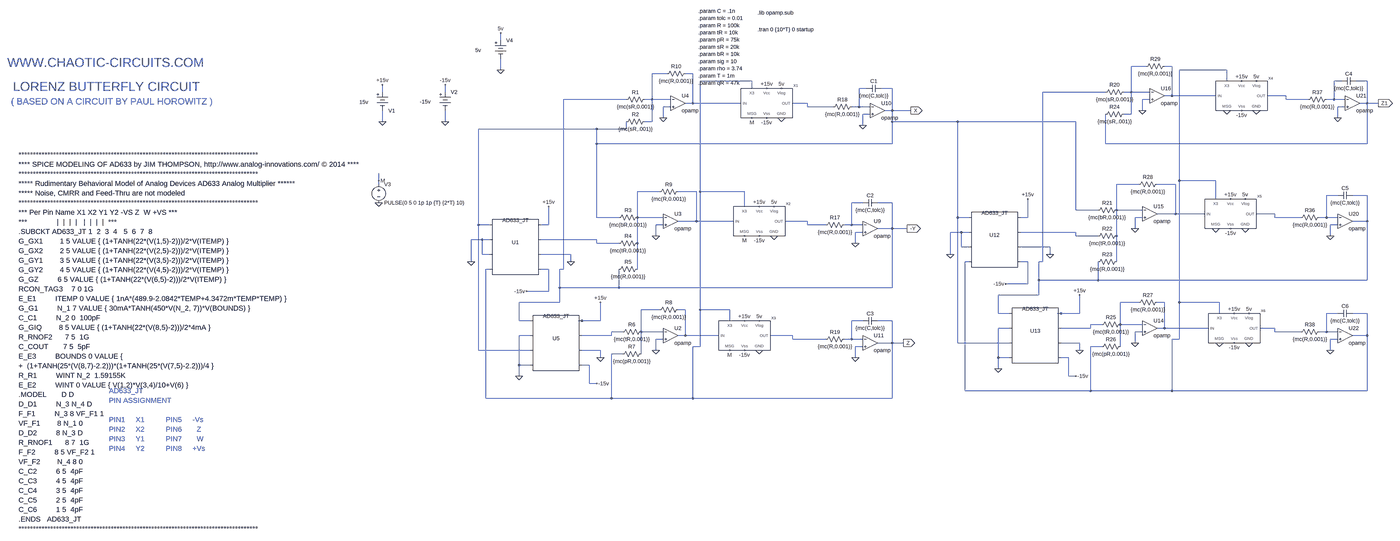
[diagram p0: schematic CSK_TS_MC_03.asc, whole sheet]
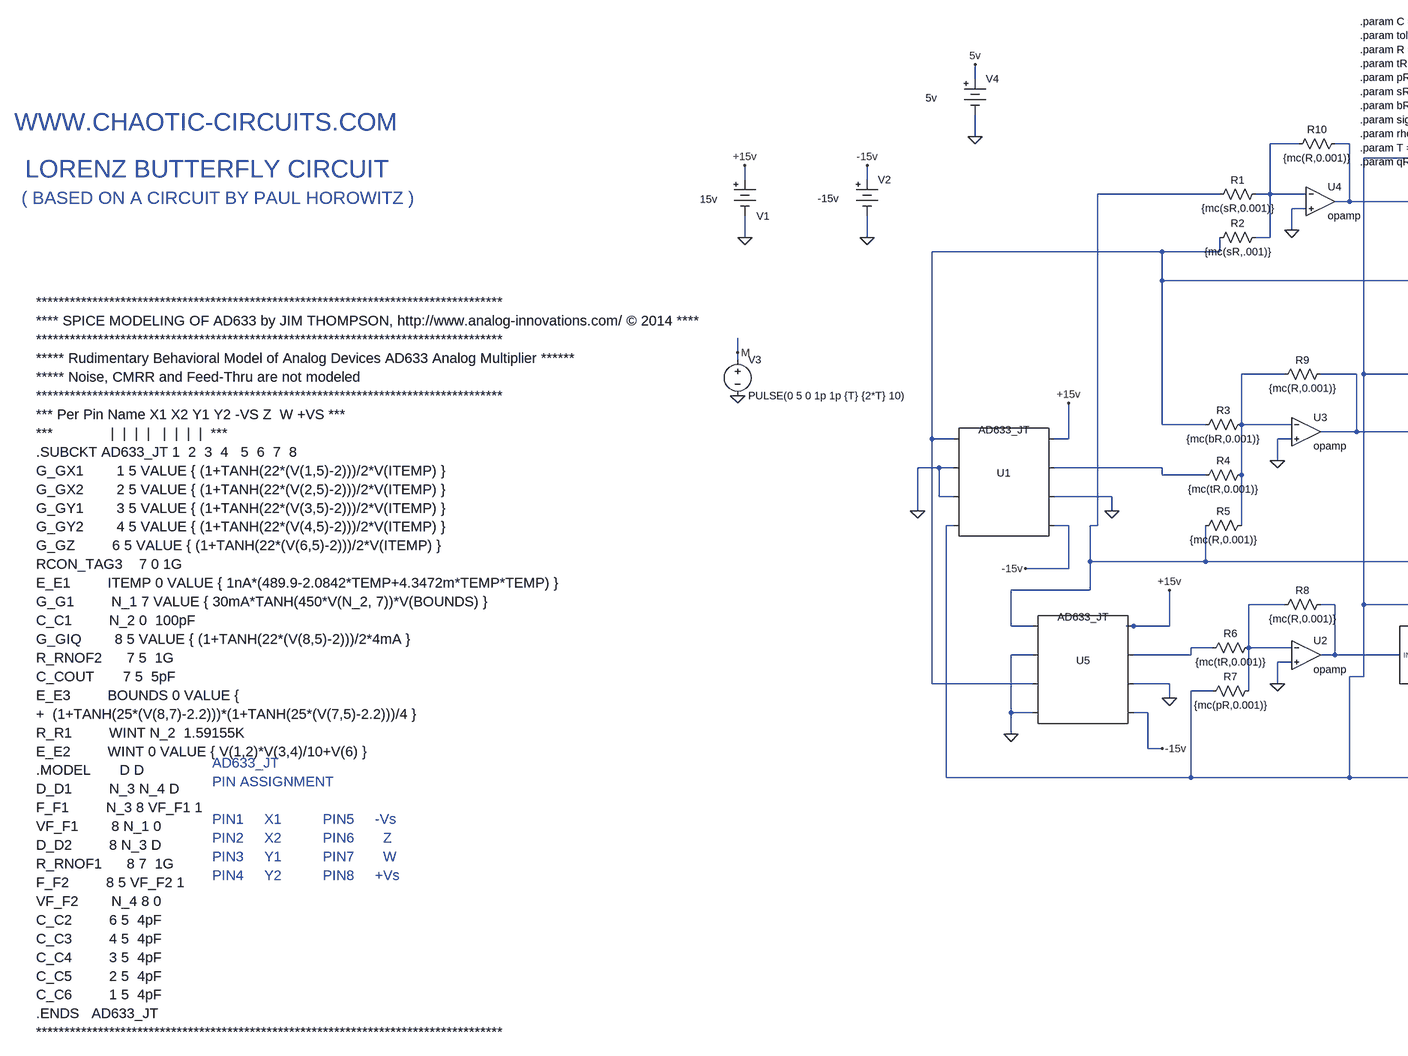
[diagram p1: schematic CSK_TS_MC_03.asc, part, row 1 of 1, column 1 of 2]
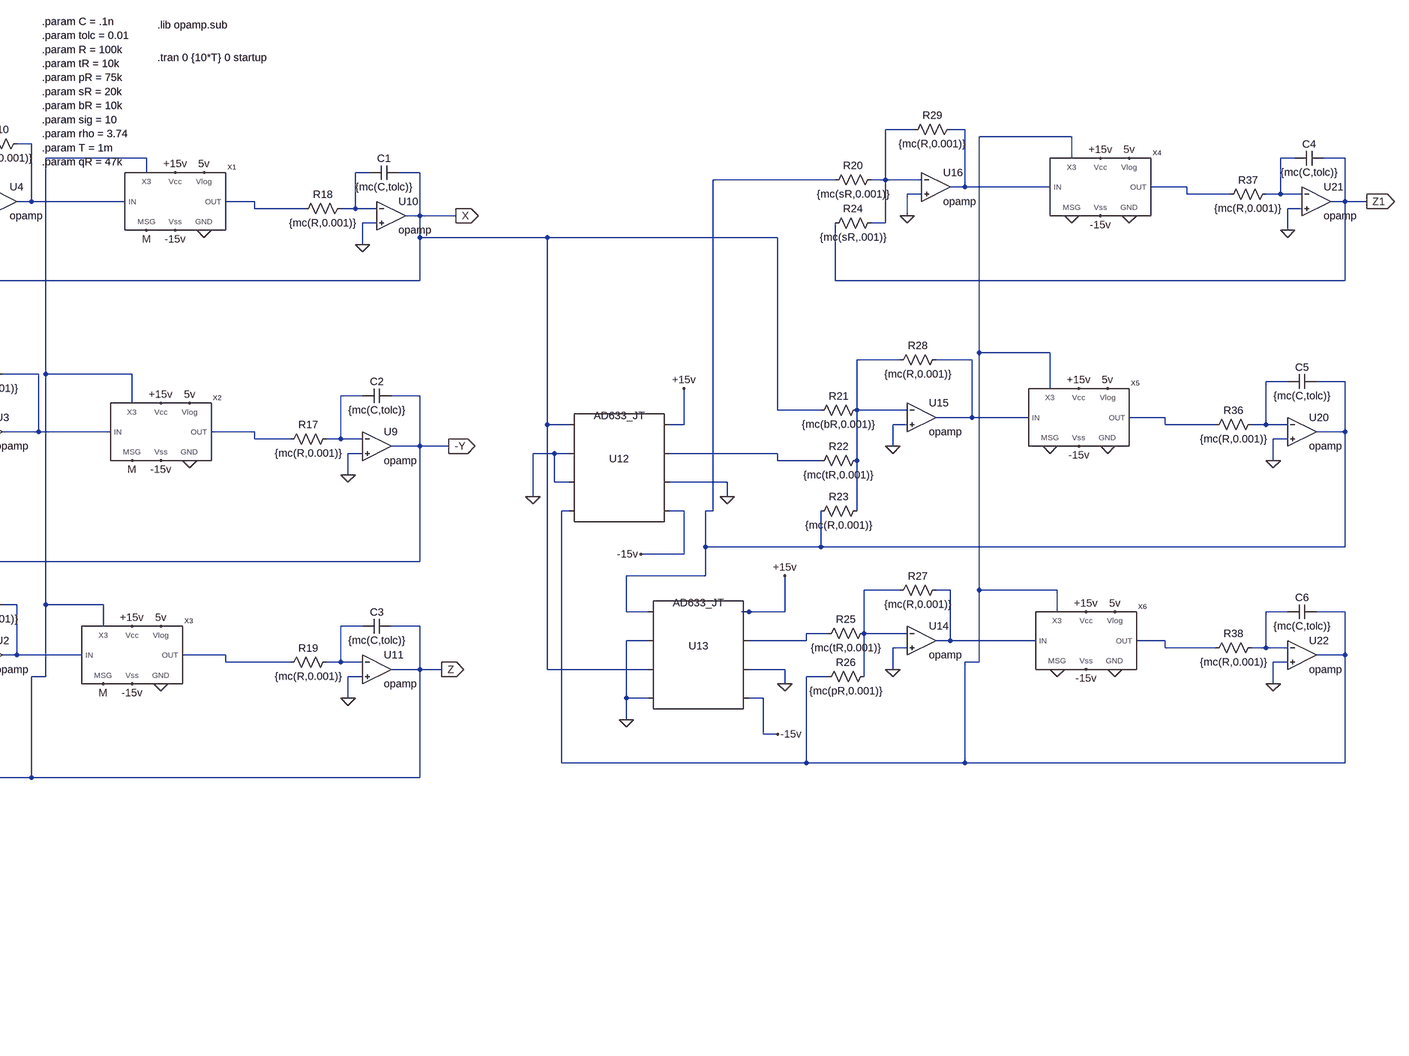
[diagram p2: schematic CSK_TS_MC_03.asc, part, row 1 of 1, column 2 of 2]
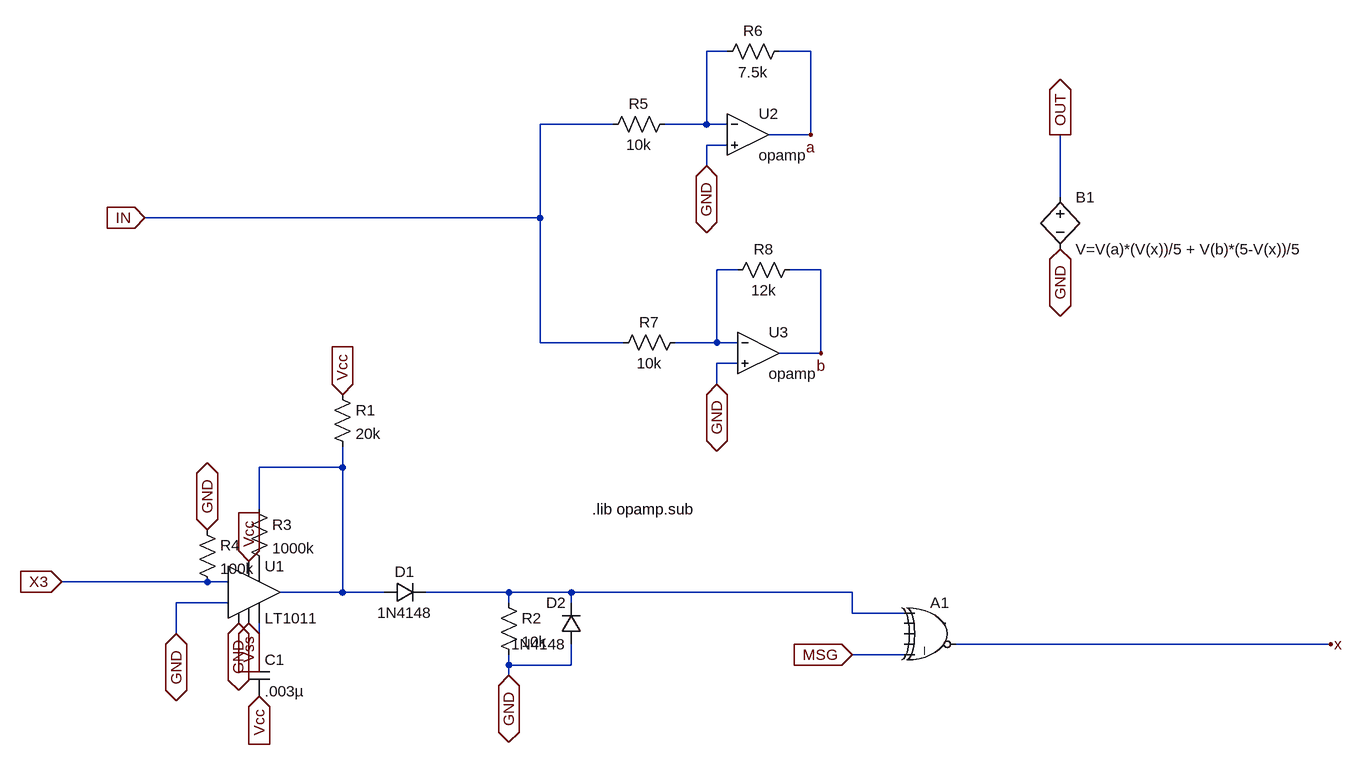
[diagram p3: sub-circuit tsblock_2.asc]
CSK_TS_MC_03.asc, the LTspice schematic file:
Version 4
SHEET 1 880 2376
WIRE -4160 400 -4160 368
WIRE -800 512 -864 512
WIRE -688 512 -720 512
WIRE -4160 528 -4160 480
WIRE -432 528 -656 528
WIRE -3440 544 -3504 544
WIRE -3328 544 -3360 544
WIRE -3072 576 -3296 576
WIRE -432 576 -432 528
WIRE 64 576 32 576
WIRE 176 576 128 576
WIRE -3072 608 -3072 576
WIRE -2576 608 -2608 608
WIRE -2464 608 -2512 608
WIRE -4672 624 -4672 592
WIRE -4400 624 -4400 592
WIRE -976 624 -1248 624
WIRE -864 624 -864 512
WIRE -864 624 -896 624
WIRE -784 624 -864 624
WIRE -688 640 -688 512
WIRE -688 640 -720 640
WIRE -480 640 -688 640
WIRE -176 640 -256 640
WIRE -3616 656 -3888 656
WIRE -3504 656 -3504 544
WIRE -3504 656 -3536 656
WIRE -3424 656 -3504 656
WIRE -784 656 -816 656
WIRE -176 656 -176 640
WIRE -80 656 -176 656
WIRE 32 656 32 576
WIRE 32 656 0 656
WIRE 80 656 32 656
WIRE -3328 672 -3328 544
WIRE -3328 672 -3360 672
WIRE -3120 672 -3328 672
WIRE -2832 672 -2896 672
WIRE 176 672 176 576
WIRE 176 672 144 672
WIRE 224 672 176 672
WIRE -3424 688 -3456 688
WIRE -2832 688 -2832 672
WIRE -2720 688 -2832 688
WIRE -2608 688 -2608 608
WIRE -2608 688 -2640 688
WIRE -2560 688 -2608 688
WIRE 80 688 48 688
WIRE -2464 704 -2464 608
WIRE -2464 704 -2496 704
WIRE -2384 704 -2464 704
WIRE -816 704 -816 656
WIRE -2560 720 -2592 720
WIRE -864 720 -864 624
WIRE -864 720 -896 720
WIRE -3456 736 -3456 688
WIRE 48 736 48 688
WIRE -4672 752 -4672 704
WIRE -4400 752 -4400 704
WIRE -3504 752 -3504 656
WIRE -3504 752 -3536 752
WIRE -2464 752 -2464 704
WIRE -1616 752 -2464 752
WIRE -1104 752 -1616 752
WIRE -2592 768 -2592 720
WIRE -3744 784 -4256 784
WIRE -3616 784 -3616 752
WIRE -3616 784 -3744 784
WIRE -3744 848 -3744 784
WIRE -2464 848 -2464 752
WIRE -2464 848 -3744 848
WIRE -976 848 -976 720
WIRE 176 848 176 672
WIRE 176 848 -976 848
WIRE -4688 1008 -4688 976
WIRE -656 1008 -656 528
WIRE -480 1008 -656 1008
WIRE -4688 1024 -4688 1008
WIRE -832 1024 -928 1024
WIRE -672 1024 -752 1024
WIRE -3472 1056 -3568 1056
WIRE -3312 1056 -3392 1056
WIRE -3296 1056 -3296 576
WIRE -3104 1056 -3296 1056
WIRE 48 1072 0 1072
WIRE 176 1072 112 1072
WIRE -480 1088 -480 1008
WIRE -2592 1104 -2640 1104
WIRE -2464 1104 -2528 1104
WIRE -3104 1120 -3104 1056
WIRE -1104 1136 -1104 752
WIRE -1008 1136 -1104 1136
WIRE -928 1136 -928 1024
WIRE -816 1136 -928 1136
WIRE -672 1152 -672 1024
WIRE -672 1152 -752 1152
WIRE -528 1152 -672 1152
WIRE -224 1152 -304 1152
WIRE -3744 1168 -3744 848
WIRE -3648 1168 -3744 1168
WIRE -3568 1168 -3568 1056
WIRE -3456 1168 -3568 1168
WIRE -1616 1168 -1616 752
WIRE -1568 1168 -1616 1168
WIRE -1312 1168 -1312 1088
WIRE -1312 1168 -1344 1168
WIRE -816 1168 -848 1168
WIRE -224 1168 -224 1152
WIRE -112 1168 -224 1168
WIRE 0 1168 0 1072
WIRE 0 1168 -32 1168
WIRE 48 1168 0 1168
WIRE -3312 1184 -3312 1056
WIRE -3312 1184 -3392 1184
WIRE -3152 1184 -3312 1184
WIRE -2832 1184 -2928 1184
WIRE 176 1184 176 1072
WIRE 176 1184 112 1184
WIRE -4256 1200 -4256 784
WIRE -4208 1200 -4256 1200
WIRE -3952 1200 -3952 1120
WIRE -3952 1200 -3984 1200
WIRE -3456 1200 -3488 1200
WIRE -2832 1200 -2832 1184
WIRE -2752 1200 -2832 1200
WIRE -2640 1200 -2640 1104
WIRE -2640 1200 -2672 1200
WIRE -2592 1200 -2640 1200
WIRE 48 1200 16 1200
WIRE -2464 1216 -2464 1104
WIRE -2464 1216 -2528 1216
WIRE -2400 1216 -2464 1216
WIRE -848 1216 -848 1168
WIRE -2592 1232 -2624 1232
WIRE -1600 1232 -1648 1232
WIRE -1568 1232 -1600 1232
WIRE -1104 1232 -1344 1232
WIRE -3488 1248 -3488 1200
WIRE -1104 1248 -1104 1232
WIRE -1008 1248 -1104 1248
WIRE -928 1248 -928 1136
WIRE 16 1248 16 1200
WIRE -4240 1264 -4288 1264
WIRE -4208 1264 -4240 1264
WIRE -3744 1264 -3984 1264
WIRE -3744 1280 -3744 1264
WIRE -3648 1280 -3744 1280
WIRE -3568 1280 -3568 1168
WIRE -2624 1280 -2624 1232
WIRE -1600 1296 -1600 1232
WIRE -1568 1296 -1600 1296
WIRE -1216 1296 -1344 1296
WIRE -4240 1328 -4240 1264
WIRE -4208 1328 -4240 1328
WIRE -3856 1328 -3984 1328
WIRE -1648 1328 -1648 1232
WIRE -1216 1328 -1216 1296
WIRE -4288 1360 -4288 1264
WIRE -3856 1360 -3856 1328
WIRE -1568 1360 -1584 1360
WIRE -1312 1360 -1344 1360
WIRE -1248 1360 -1248 624
WIRE -1248 1360 -1264 1360
WIRE -928 1360 -928 1248
WIRE -4208 1392 -4224 1392
WIRE -3952 1392 -3984 1392
WIRE -3888 1392 -3888 656
WIRE -3888 1392 -3904 1392
WIRE -3568 1392 -3568 1280
WIRE -1264 1440 -1264 1360
WIRE -1008 1440 -1008 1360
WIRE -1008 1440 -1264 1440
WIRE 176 1440 176 1184
WIRE 176 1440 -1008 1440
WIRE -1312 1456 -1312 1360
WIRE -1312 1456 -1408 1456
WIRE -3904 1472 -3904 1392
WIRE -3648 1472 -3648 1392
WIRE -3648 1472 -3904 1472
WIRE -2464 1472 -2464 1216
WIRE -2464 1472 -3648 1472
WIRE -3952 1488 -3952 1392
WIRE -3952 1488 -4048 1488
WIRE -1264 1504 -1264 1440
WIRE -1264 1504 -1440 1504
WIRE -3904 1536 -3904 1472
WIRE -3904 1536 -4080 1536
WIRE -832 1536 -912 1536
WIRE -720 1536 -752 1536
WIRE -656 1536 -656 1008
WIRE -464 1536 -656 1536
WIRE -3472 1568 -3552 1568
WIRE -3360 1568 -3392 1568
WIRE -3296 1568 -3296 1056
WIRE -3168 1568 -3296 1568
WIRE -1440 1584 -1440 1504
WIRE -1392 1584 -1440 1584
WIRE -1168 1584 -1184 1584
WIRE -1088 1584 -1088 1504
WIRE -1088 1584 -1168 1584
WIRE -464 1584 -464 1536
WIRE 48 1584 0 1584
WIRE 176 1584 112 1584
WIRE -4080 1616 -4080 1536
WIRE -4032 1616 -4080 1616
WIRE -3808 1616 -3824 1616
WIRE -3728 1616 -3728 1536
WIRE -3728 1616 -3808 1616
WIRE -3168 1616 -3168 1568
WIRE -2592 1616 -2640 1616
WIRE -2464 1616 -2528 1616
WIRE -992 1632 -1040 1632
WIRE -912 1632 -912 1536
WIRE -816 1632 -912 1632
WIRE -1392 1648 -1440 1648
WIRE -1040 1648 -1040 1632
WIRE -1040 1648 -1168 1648
WIRE -720 1648 -720 1536
WIRE -720 1648 -752 1648
WIRE -512 1648 -720 1648
WIRE -224 1648 -288 1648
WIRE -3632 1664 -3680 1664
WIRE -3552 1664 -3552 1568
WIRE -3456 1664 -3552 1664
WIRE -816 1664 -848 1664
WIRE -224 1664 -224 1648
WIRE -112 1664 -224 1664
WIRE 0 1664 0 1584
WIRE 0 1664 -32 1664
WIRE 48 1664 0 1664
WIRE -4032 1680 -4080 1680
WIRE -3680 1680 -3680 1664
WIRE -3680 1680 -3808 1680
WIRE -3360 1680 -3360 1568
WIRE -3360 1680 -3392 1680
WIRE -3216 1680 -3360 1680
WIRE -2896 1680 -2992 1680
WIRE 176 1680 176 1584
WIRE 176 1680 112 1680
WIRE -3456 1696 -3488 1696
WIRE -2896 1696 -2896 1680
WIRE -2752 1696 -2896 1696
WIRE -2640 1696 -2640 1616
WIRE -2640 1696 -2672 1696
WIRE -2592 1696 -2640 1696
WIRE -656 1696 -656 1536
WIRE -656 1696 -688 1696
WIRE 48 1696 16 1696
WIRE -2464 1712 -2464 1616
WIRE -2464 1712 -2528 1712
WIRE -2416 1712 -2464 1712
WIRE -1616 1712 -1616 1168
WIRE -1392 1712 -1616 1712
WIRE -1088 1712 -1168 1712
WIRE -848 1712 -848 1664
WIRE -3296 1728 -3296 1568
WIRE -3296 1728 -3328 1728
WIRE -2592 1728 -2624 1728
WIRE -992 1728 -1040 1728
WIRE -912 1728 -912 1632
WIRE -4256 1744 -4256 1200
WIRE -4032 1744 -4256 1744
WIRE -3728 1744 -3808 1744
WIRE -3488 1744 -3488 1696
WIRE -1088 1744 -1088 1712
WIRE 16 1744 16 1696
WIRE -3632 1760 -3680 1760
WIRE -3552 1760 -3552 1664
WIRE -3728 1776 -3728 1744
WIRE -2624 1776 -2624 1728
WIRE -1440 1776 -1440 1648
WIRE -1392 1776 -1440 1776
WIRE -1136 1776 -1168 1776
WIRE -4080 1808 -4080 1680
WIRE -4032 1808 -4080 1808
WIRE -3776 1808 -3808 1808
WIRE -1440 1824 -1440 1776
WIRE -4080 1856 -4080 1808
WIRE -1136 1856 -1136 1776
WIRE -1104 1856 -1136 1856
WIRE -3776 1888 -3776 1808
WIRE -3744 1888 -3776 1888
WIRE -1584 1920 -1584 1360
WIRE -1040 1920 -1040 1728
WIRE -1040 1920 -1584 1920
WIRE -688 1920 -688 1696
WIRE -688 1920 -1040 1920
WIRE 176 1920 176 1680
WIRE 176 1920 -688 1920
WIRE -4224 1952 -4224 1392
WIRE -3680 1952 -3680 1760
WIRE -3680 1952 -4224 1952
WIRE -3328 1952 -3328 1728
WIRE -3328 1952 -3680 1952
WIRE -2464 1952 -2464 1712
WIRE -2464 1952 -3328 1952
FLAG -2416 1712 Z
IOPIN -2416 1712 Out
FLAG -3456 736 0
FLAG -3488 1248 0
FLAG -3488 1744 0
FLAG -4672 752 0
FLAG -4400 752 0
FLAG -2400 1216 -Y
IOPIN -2400 1216 Out
FLAG -4672 592 +15v
FLAG -4400 592 -15v
FLAG -3952 1120 +15v
FLAG -3728 1536 +15v
FLAG -3744 1888 -15v
FLAG -4048 1488 -15v
FLAG -3728 1776 0
FLAG -3856 1360 0
FLAG -4288 1360 0
FLAG -4080 1856 0
FLAG -4688 1104 0
FLAG -4688 1008 M
FLAG -2384 704 X
IOPIN -2384 704 Out
FLAG -2624 1280 0
FLAG -2592 768 0
FLAG -2624 1776 0
FLAG 224 672 Z1
IOPIN 224 672 Out
FLAG -816 704 0
FLAG -848 1216 0
FLAG -848 1712 0
FLAG -1312 1088 +15v
FLAG -1088 1504 +15v
FLAG -1104 1856 -15v
FLAG -1408 1456 -15v
FLAG -1088 1744 0
FLAG -1216 1328 0
FLAG -1648 1328 0
FLAG -1440 1824 0
FLAG 16 1248 0
FLAG 48 736 0
FLAG 16 1744 0
FLAG -2976 1248 0
FLAG -2944 736 0
FLAG -3040 1744 0
FLAG -432 704 0
FLAG -304 704 0
FLAG -480 1216 0
FLAG -352 1216 0
FLAG -464 1712 0
FLAG -336 1712 0
FLAG -3040 1120 +15v
FLAG -3008 608 +15v
FLAG -3104 1616 +15v
FLAG -368 576 +15v
FLAG -416 1088 +15v
FLAG -400 1584 +15v
FLAG -400 1712 -15v
FLAG -416 1216 -15v
FLAG -368 704 -15v
FLAG -3008 736 -15v
FLAG -3040 1248 -15v
FLAG -3104 1744 -15v
FLAG -3072 736 M
FLAG -3104 1248 M
FLAG -3168 1744 M
FLAG -4160 528 0
FLAG -4160 368 5v
FLAG -2944 608 5v
FLAG -2976 1120 5v
FLAG -3040 1616 5v
FLAG -352 1088 5v
FLAG -336 1584 5v
FLAG -304 576 5v
SYMBOL res -3632 672 R270
WINDOW 0 32 56 VTop 2
WINDOW 3 0 56 VBottom 2
SYMATTR InstName R1
SYMATTR Value {mc(sR,0.001)}
SYMATTR SpiceLine tol=1
SYMBOL res -3664 1184 R270
WINDOW 0 32 56 VTop 2
WINDOW 3 0 56 VBottom 2
SYMATTR InstName R3
SYMATTR Value {mc(bR,0.001)}
SYMATTR SpiceLine tol=1
SYMBOL res -3664 1296 R270
WINDOW 0 32 56 VTop 2
WINDOW 3 0 56 VBottom 2
SYMATTR InstName R4
SYMATTR Value {mc(tR,0.001)}
SYMATTR SpiceLine tol=1
SYMBOL res -3664 1408 R270
WINDOW 0 32 56 VTop 2
WINDOW 3 0 56 VBottom 2
SYMATTR InstName R5
SYMATTR Value {mc(R,0.001)}
SYMATTR SpiceLine tol=1
SYMBOL res -3632 768 R270
WINDOW 0 32 56 VTop 2
WINDOW 3 0 56 VBottom 2
SYMATTR InstName R2
SYMATTR Value {mc(sR,.001)}
SYMATTR SpiceLine tol=1
SYMBOL cap -2576 624 R270
WINDOW 0 32 32 VTop 2
WINDOW 3 0 32 VBottom 2
SYMATTR InstName C1
SYMATTR Value {mc(C,tolc)}
SYMBOL cap -2592 1120 R270
WINDOW 0 32 32 VTop 2
WINDOW 3 0 32 VBottom 2
SYMATTR InstName C2
SYMATTR Value {mc(C,tolc)}
SYMBOL cap -2592 1632 R270
WINDOW 0 32 32 VTop 2
WINDOW 3 0 32 VBottom 2
SYMATTR InstName C3
SYMATTR Value {mc(C,tolc)}
SYMBOL res -3648 1680 R270
WINDOW 0 32 56 VTop 2
WINDOW 3 0 56 VBottom 2
SYMATTR InstName R6
SYMATTR Value {mc(tR,0.001)}
SYMATTR SpiceLine tol=1
SYMBOL res -3648 1776 R270
WINDOW 0 32 56 VTop 2
WINDOW 3 0 56 VBottom 2
SYMATTR InstName R7
SYMATTR Value {mc(pR,0.001)}
SYMATTR SpiceLine tol=1
SYMBOL Misc\\battery -4672 608 R0
WINDOW 0 26 97 Left 2
WINDOW 3 -100 59 Left 2
WINDOW 123 0 0 Left 2
WINDOW 39 0 0 Left 2
SYMATTR InstName V1
SYMATTR Value 15v
SYMBOL Misc\\battery -4400 608 R0
WINDOW 3 -110 58 Left 2
WINDOW 123 0 0 Left 2
WINDOW 39 0 0 Left 2
SYMATTR Value -15v
SYMATTR InstName V2
SYMBOL Misc\\DIP8 -4096 1296 R0
WINDOW 3 0 -116 Center 2
SYMATTR Value AD633_JT
SYMATTR InstName U1
SYMBOL Misc\\DIP8 -3920 1712 R0
WINDOW 3 0 -116 Center 2
SYMATTR Value AD633_JT
SYMATTR InstName U5
SYMBOL Opamps\\opamp -3424 1616 R0
SYMATTR InstName U2
SYMBOL Opamps\\opamp -3424 1120 R0
SYMATTR InstName U3
SYMBOL Opamps\\opamp -3392 608 R0
SYMATTR InstName U4
SYMBOL voltage -4688 1008 R0
WINDOW 123 0 0 Left 2
WINDOW 39 0 0 Left 2
SYMATTR InstName V3
SYMATTR Value PULSE(0 5 0 1p 1p {T} {2*T} 10)
SYMBOL res -3376 1552 R90
WINDOW 0 0 56 VBottom 2
WINDOW 3 32 56 VTop 2
SYMATTR InstName R8
SYMATTR Value {mc(R,0.001)}
SYMBOL res -3376 1040 R90
WINDOW 0 0 56 VBottom 2
WINDOW 3 32 56 VTop 2
SYMATTR InstName R9
SYMATTR Value {mc(R,0.001)}
SYMBOL res -3344 528 R90
WINDOW 0 0 56 VBottom 2
WINDOW 3 32 56 VTop 2
SYMATTR InstName R10
SYMATTR Value {mc(R,0.001)}
SYMBOL Opamps\\opamp -2560 1152 R0
SYMATTR InstName U9
SYMBOL res -2656 1184 R90
WINDOW 0 0 56 VBottom 2
WINDOW 3 32 56 VTop 2
SYMATTR InstName R17
SYMATTR Value {mc(R,0.001)}
SYMBOL Opamps\\opamp -2528 640 R0
SYMATTR InstName U10
SYMBOL res -2624 672 R90
WINDOW 0 0 56 VBottom 2
WINDOW 3 32 56 VTop 2
SYMATTR InstName R18
SYMATTR Value {mc(R,0.001)}
SYMBOL Opamps\\opamp -2560 1648 R0
SYMATTR InstName U11
SYMBOL res -2656 1680 R90
WINDOW 0 0 56 VBottom 2
WINDOW 3 32 56 VTop 2
SYMATTR InstName R19
SYMATTR Value {mc(R,0.001)}
SYMBOL res -992 640 R270
WINDOW 0 32 56 VTop 2
WINDOW 3 0 56 VBottom 2
SYMATTR InstName R20
SYMATTR Value {mc(sR,0.001)}
SYMATTR SpiceLine tol=1
SYMBOL res -1024 1152 R270
WINDOW 0 32 56 VTop 2
WINDOW 3 0 56 VBottom 2
SYMATTR InstName R21
SYMATTR Value {mc(bR,0.001)}
SYMATTR SpiceLine tol=1
SYMBOL res -1024 1264 R270
WINDOW 0 32 56 VTop 2
WINDOW 3 0 56 VBottom 2
SYMATTR InstName R22
SYMATTR Value {mc(tR,0.001)}
SYMATTR SpiceLine tol=1
SYMBOL res -1024 1376 R270
WINDOW 0 32 56 VTop 2
WINDOW 3 0 56 VBottom 2
SYMATTR InstName R23
SYMATTR Value {mc(R,0.001)}
SYMATTR SpiceLine tol=1
SYMBOL res -992 736 R270
WINDOW 0 32 56 VTop 2
WINDOW 3 0 56 VBottom 2
SYMATTR InstName R24
SYMATTR Value {mc(sR,.001)}
SYMATTR SpiceLine tol=1
SYMBOL cap 64 592 R270
WINDOW 0 32 32 VTop 2
WINDOW 3 0 32 VBottom 2
SYMATTR InstName C4
SYMATTR Value {mc(C,tolc)}
SYMBOL cap 48 1088 R270
WINDOW 0 32 32 VTop 2
WINDOW 3 0 32 VBottom 2
SYMATTR InstName C5
SYMATTR Value {mc(C,tolc)}
SYMBOL cap 48 1600 R270
WINDOW 0 32 32 VTop 2
WINDOW 3 0 32 VBottom 2
SYMATTR InstName C6
SYMATTR Value {mc(C,tolc)}
SYMBOL res -1008 1648 R270
WINDOW 0 32 56 VTop 2
WINDOW 3 0 56 VBottom 2
SYMATTR InstName R25
SYMATTR Value {mc(tR,0.001)}
SYMATTR SpiceLine tol=1
SYMBOL res -1008 1744 R270
WINDOW 0 32 56 VTop 2
WINDOW 3 0 56 VBottom 2
SYMATTR InstName R26
SYMATTR Value {mc(pR,0.001)}
SYMATTR SpiceLine tol=1
SYMBOL Misc\\DIP8 -1456 1264 R0
WINDOW 3 0 -116 Center 2
SYMATTR Value AD633_JT
SYMATTR InstName U12
SYMBOL Misc\\DIP8 -1280 1680 R0
WINDOW 3 0 -116 Center 2
SYMATTR Value AD633_JT
SYMATTR InstName U13
SYMBOL Opamps\\opamp -784 1584 R0
SYMATTR InstName U14
SYMBOL Opamps\\opamp -784 1088 R0
SYMATTR InstName U15
SYMBOL Opamps\\opamp -752 576 R0
SYMATTR InstName U16
SYMBOL res -736 1520 R90
WINDOW 0 0 56 VBottom 2
WINDOW 3 32 56 VTop 2
SYMATTR InstName R27
SYMATTR Value {mc(R,0.001)}
SYMBOL res -736 1008 R90
WINDOW 0 0 56 VBottom 2
WINDOW 3 32 56 VTop 2
SYMATTR InstName R28
SYMATTR Value {mc(R,0.001)}
SYMBOL res -704 496 R90
WINDOW 0 0 56 VBottom 2
WINDOW 3 32 56 VTop 2
SYMATTR InstName R29
SYMATTR Value {mc(R,0.001)}
SYMBOL Opamps\\opamp 80 1120 R0
SYMATTR InstName U20
SYMBOL res -16 1152 R90
WINDOW 0 0 56 VBottom 2
WINDOW 3 32 56 VTop 2
SYMATTR InstName R36
SYMATTR Value {mc(R,0.001)}
SYMBOL Opamps\\opamp 112 608 R0
SYMATTR InstName U21
SYMBOL res 16 640 R90
WINDOW 0 0 56 VBottom 2
WINDOW 3 32 56 VTop 2
SYMATTR InstName R37
SYMATTR Value {mc(R,0.001)}
SYMBOL Opamps\\opamp 80 1616 R0
SYMATTR InstName U22
SYMBOL res -16 1648 R90
WINDOW 0 0 56 VBottom 2
WINDOW 3 32 56 VTop 2
SYMATTR InstName R38
SYMATTR Value {mc(R,0.001)}
SYMBOL TSBlock_2 -3008 672 R0
SYMATTR InstName X1
SYMBOL TSBlock_2 -3040 1184 R0
SYMATTR InstName X2
SYMBOL TSBlock_2 -3104 1680 R0
SYMATTR InstName X3
SYMBOL TSBlock_2 -368 640 R0
SYMATTR InstName X4
SYMBOL TSBlock_2 -416 1152 R0
SYMATTR InstName X5
SYMBOL TSBlock_2 -400 1648 R0
SYMATTR InstName X6
SYMBOL Misc\\battery -4160 384 R0
WINDOW 3 -110 58 Left 2
WINDOW 123 0 0 Left 2
WINDOW 39 0 0 Left 2
SYMATTR Value 5v
SYMATTR InstName V4
TEXT -3048 352 Left 2 !.tran 0 {10*T} 0 startup
TEXT -6280 664 Left 4 ;( BASED ON A CIRCUIT BY PAUL HOROWITZ )
TEXT -6272 600 Left 5 ;LORENZ BUTTERFLY CIRCUIT
TEXT -6296 496 Left 5 ;WWW.CHAOTIC-CIRCUITS.COM
TEXT -6248 896 Left 3 !***********************************************************************************\n**** SPICE MODELING OF AD633 by JIM THOMPSON, http://www.analog-innovations.com/ © 2014 ****\n***********************************************************************************\n***** Rudimentary Behavioral Model of Analog Devices AD633 Analog Multiplier ******\n***** Noise, CMRR and Feed-Thru are not modeled\n***********************************************************************************\n*** Per Pin Name X1 X2 Y1 Y2 -VS Z  W +VS ***\n***              |  |  |  |   |  |  |  |  ***\n.SUBCKT AD633_JT 1  2  3  4   5  6  7  8 \nG_GX1        1 5 VALUE { (1+TANH(22*(V(1,5)-2)))/2*V(ITEMP) }\nG_GX2        2 5 VALUE { (1+TANH(22*(V(2,5)-2)))/2*V(ITEMP) }\nG_GY1        3 5 VALUE { (1+TANH(22*(V(3,5)-2)))/2*V(ITEMP) }\nG_GY2        4 5 VALUE { (1+TANH(22*(V(4,5)-2)))/2*V(ITEMP) }\nG_GZ         6 5 VALUE { (1+TANH(22*(V(6,5)-2)))/2*V(ITEMP) }\nRCON_TAG3    7 0 1G\nE_E1         ITEMP 0 VALUE { 1nA*(489.9-2.0842*TEMP+4.3472m*TEMP*TEMP) }\nG_G1         N_1 7 VALUE { 30mA*TANH(450*V(N_2, 7))*V(BOUNDS) }\nC_C1         N_2 0  100pF \nG_GIQ        8 5 VALUE { (1+TANH(22*(V(8,5)-2)))/2*4mA }\nR_RNOF2      7 5  1G \nC_COUT       7 5  5pF \nE_E3         BOUNDS 0 VALUE {\n+  (1+TANH(25*(V(8,7)-2.2)))*(1+TANH(25*(V(7,5)-2.2)))/4 }\nR_R1         WINT N_2  1.59155K \nE_E2         WINT 0 VALUE { V(1,2)*V(3,4)/10+V(6) }\n.MODEL       D D\nD_D1         N_3 N_4 D \nF_F1         N_3 8 VF_F1 1\nVF_F1        8 N_1 0\nD_D2         8 N_3 D \nR_RNOF1      8 7  1G \nF_F2         8 5 VF_F2 1\nVF_F2        N_4 8 0\nC_C2         6 5  4pF \nC_C3         4 5  4pF \nC_C4         3 5  4pF \nC_C5         2 5  4pF \nC_C6         1 5  4pF \n.ENDS   AD633_JT\n***********************************************************************************
TEXT -5856 1920 Left 3 ;AD633_JT\nPIN ASSIGNMENT\n \nPIN1     X1          PIN5     -Vs\nPIN2     X2          PIN6       Z\nPIN3     Y1          PIN7       W\nPIN4     Y2          PIN8     +Vs
TEXT -3048 280 Left 2 !.lib opamp.sub
TEXT -3304 272 Left 2 !.param C = .1n\n.param tolc = 0.01\n.param R = 100k\n.param tR = 10k\n.param pR = 75k\n.param sR = 20k\n.param bR = 10k\n.param sig = 10\n.param rho = 3.74\n.param T = 1m\n.param qR = 47k

tsblock_2.asc, the sub-circuit schematic file:
Version 4
SHEET 1 880 680
WIRE -1456 -912 -1488 -912
WIRE -1328 -912 -1376 -912
WIRE -1632 -800 -1744 -800
WIRE -1488 -800 -1488 -912
WIRE -1488 -800 -1552 -800
WIRE -1456 -800 -1488 -800
WIRE -1328 -784 -1328 -912
WIRE -1328 -784 -1392 -784
WIRE -1456 -768 -1488 -768
WIRE -1488 -736 -1488 -768
WIRE -944 -688 -944 -784
WIRE -1744 -656 -1744 -800
WIRE -1744 -656 -2352 -656
WIRE -1440 -576 -1472 -576
WIRE -1312 -576 -1360 -576
WIRE -1744 -464 -1744 -656
WIRE -1616 -464 -1744 -464
WIRE -1472 -464 -1472 -576
WIRE -1472 -464 -1536 -464
WIRE -1440 -464 -1472 -464
WIRE -1312 -448 -1312 -576
WIRE -1312 -448 -1376 -448
WIRE -1440 -432 -1472 -432
WIRE -1472 -400 -1472 -432
WIRE -2048 -272 -2048 -304
WIRE -2048 -272 -2176 -272
WIRE -2176 -208 -2176 -272
WIRE -2256 -96 -2480 -96
WIRE -2224 -96 -2256 -96
WIRE -2048 -80 -2048 -272
WIRE -2048 -80 -2144 -80
WIRE -1984 -80 -2048 -80
WIRE -1792 -80 -1920 -80
WIRE -1696 -80 -1792 -80
WIRE -1264 -80 -1696 -80
WIRE -2224 -64 -2304 -64
WIRE -1792 -64 -1792 -80
WIRE -1696 -64 -1696 -80
WIRE -1264 -48 -1264 -80
WIRE -1184 -48 -1264 -48
WIRE -2304 -16 -2304 -64
WIRE -528 0 -1104 0
WIRE -2176 16 -2176 -32
WIRE -1184 16 -1264 16
WIRE -1792 32 -1792 16
WIRE -1696 32 -1696 0
WIRE -1696 32 -1792 32
WIRE -1792 48 -1792 32
FLAG -2048 -384 Vcc
IOPIN -2048 -384 In
FLAG -2192 -128 Vcc
IOPIN -2192 -128 In
FLAG -2176 80 Vcc
IOPIN -2176 80 In
FLAG -2192 -32 Vss
IOPIN -2192 -32 In
FLAG -1792 48 GND
IOPIN -1792 48 BiDir
FLAG -2208 -32 GND
IOPIN -2208 -32 BiDir
FLAG -2304 -16 GND
IOPIN -2304 -16 BiDir
FLAG -2256 -176 GND
IOPIN -2256 -176 BiDir
FLAG -1488 -736 GND
IOPIN -1488 -736 BiDir
FLAG -1472 -400 GND
IOPIN -1472 -400 BiDir
FLAG -2352 -656 IN
IOPIN -2352 -656 In
FLAG -944 -784 OUT
IOPIN -944 -784 Out
FLAG -2480 -96 X3
IOPIN -2480 -96 In
FLAG -1264 16 MSG
IOPIN -1264 16 In
FLAG -528 0 x
FLAG -1328 -784 a
FLAG -1312 -448 b
FLAG -944 -608 GND
IOPIN -944 -608 BiDir
SYMBOL LT1011 -2192 -80 R0
SYMATTR InstName U1
SYMBOL res -2064 -400 R0
SYMATTR InstName R1
SYMATTR Value 20k
SYMBOL res -1808 -80 R0
SYMATTR InstName R2
SYMATTR Value 10k
SYMBOL cap -2192 16 R0
SYMATTR InstName C1
SYMATTR Value .003µ
SYMBOL res -2192 -224 R0
SYMATTR InstName R3
SYMATTR Value 1000k
SYMBOL diode -1984 -64 R270
WINDOW 0 32 32 VTop 2
WINDOW 3 0 32 VBottom 2
SYMATTR InstName D1
SYMATTR Value 1N4148
SYMBOL diode -1680 0 R180
WINDOW 0 24 64 Left 2
WINDOW 3 24 0 Left 2
SYMATTR InstName D2
SYMATTR Value 1N4148
SYMBOL res -2272 -192 R0
SYMATTR InstName R4
SYMATTR Value 100k
SYMBOL opamp -1424 -848 R0
SYMATTR InstName U2
SYMBOL res -1536 -816 R90
WINDOW 0 0 56 VBottom 2
WINDOW 3 32 56 VTop 2
SYMATTR InstName R5
SYMATTR Value 10k
SYMBOL res -1360 -928 R90
WINDOW 0 0 56 VBottom 2
WINDOW 3 32 56 VTop 2
SYMATTR InstName R6
SYMATTR Value 7.5k
SYMBOL opamp -1408 -512 R0
SYMATTR InstName U3
SYMBOL res -1520 -480 R90
WINDOW 0 0 56 VBottom 2
WINDOW 3 32 56 VTop 2
SYMATTR InstName R7
SYMATTR Value 10k
SYMBOL res -1344 -592 R90
WINDOW 0 0 56 VBottom 2
WINDOW 3 32 56 VTop 2
SYMATTR InstName R8
SYMATTR Value 12k
SYMBOL Digital\\xor -1136 -80 R0
WINDOW 3 0 0 Invisible 2
SYMATTR Value Vhigh=5 Vlow=0
SYMATTR InstName A1
SYMATTR Value2 Td=2n Trise=10n Tfall=10n
SYMBOL bv -944 -704 R0
SYMATTR InstName B1
SYMATTR Value V=V(a)*(V(x))/5 + V(b)*(5-V(x))/5
TEXT -1664 -208 Left 2 !.lib opamp.sub

The netlist it stands for:
* CSK_TS_MC_03.asc
R1 -Y N004 {mc(sR,0.001)} tol=1
R3 X N013 {mc(bR,0.001)} tol=1
R4 N020 N013 {mc(tR,0.001)} tol=1
R5 -Y N013 {mc(R,0.001)} tol=1
R2 X N004 {mc(sR,.001)} tol=1
C1 N007 X {mc(C,tolc)}
C2 N016 -Y {mc(C,tolc)}
C3 N026 Z {mc(C,tolc)}
R6 N029 N023 {mc(tR,0.001)} tol=1
R7 Z N023 {mc(pR,0.001)} tol=1
V1 +15v 0 15v
V2 -15v 0 -15v
XU1 X 0 0 Z -15v 0 N020 +15v AD633_JT
XU5 -Y 0 X 0 -15v 0 N029 +15v AD633_JT
XU2 N023 0 N024 opamp Aol=100K GBW=10Meg  ; pins invin noninvin out
XU3 N013 0 N014 opamp Aol=100K GBW=10Meg  ; pins invin noninvin out
XU4 N004 0 N005 opamp Aol=100K GBW=10Meg  ; pins invin noninvin out
V3 M 0 PULSE(0 5 0 1p 1p {T} {2*T} 10)
R8 N024 N023 {mc(R,0.001)}
R9 N014 N013 {mc(R,0.001)}
R10 N005 N004 {mc(R,0.001)}
XU9 N016 0 -Y opamp Aol=100K GBW=10Meg  ; pins invin noninvin out
R17 N016 N018 {mc(R,0.001)}
XU10 N007 0 X opamp Aol=100K GBW=10Meg  ; pins invin noninvin out
R18 N007 N010 {mc(R,0.001)}
XU11 N026 0 Z opamp Aol=100K GBW=10Meg  ; pins invin noninvin out
R19 N026 N030 {mc(R,0.001)}
R20 N008 N001 {mc(sR,0.001)} tol=1
R21 X N011 {mc(bR,0.001)} tol=1
R22 N019 N011 {mc(tR,0.001)} tol=1
R23 N008 N011 {mc(R,0.001)} tol=1
R24 Z1 N001 {mc(sR,.001)} tol=1
C4 N006 Z1 {mc(C,tolc)}
C5 N015 N008 {mc(C,tolc)}
C6 N025 N003 {mc(C,tolc)}
R25 N027 N021 {mc(tR,0.001)} tol=1
R26 N003 N021 {mc(pR,0.001)} tol=1
XU12 X 0 0 N003 -15v 0 N019 +15v AD633_JT
XU13 N008 0 X 0 -15v 0 N027 +15v AD633_JT
XU14 N021 0 N022 opamp Aol=100K GBW=10Meg  ; pins invin noninvin out
XU15 N011 0 N012 opamp Aol=100K GBW=10Meg  ; pins invin noninvin out
XU16 N001 0 N002 opamp Aol=100K GBW=10Meg  ; pins invin noninvin out
R27 N022 N021 {mc(R,0.001)}
R28 N012 N011 {mc(R,0.001)}
R29 N002 N001 {mc(R,0.001)}
XU20 N015 0 N008 opamp Aol=100K GBW=10Meg  ; pins invin noninvin out
R36 N015 N017 {mc(R,0.001)}
XU21 N006 0 Z1 opamp Aol=100K GBW=10Meg  ; pins invin noninvin out
R37 N006 N009 {mc(R,0.001)}
XU22 N025 0 N003 opamp Aol=100K GBW=10Meg  ; pins invin noninvin out
R38 N025 N028 {mc(R,0.001)}
XX1 +15v -15v 5v 0 N005 N010 M Z tsblock_2
XX2 +15v -15v 5v 0 N014 N018 M Z tsblock_2
XX3 +15v -15v 5v 0 N024 N030 M Z tsblock_2
XX4 +15v -15v 5v 0 N002 N009 0 N003 tsblock_2
XX5 +15v -15v 5v 0 N012 N017 0 N003 tsblock_2
XX6 +15v -15v 5v 0 N022 N028 0 N003 tsblock_2
V4 5v 0 5v

* block symbol definitions
.subckt tsblock_2 Vcc Vss Vlog GND IN OUT MSG X3
XU1 GND GND X3 Vss P001 N005 N003 Vcc LT1011
R1 Vcc N003 20k
R2 N004 GND 10k
C1 N005 Vcc .003µ
R3 N003 P001 1000k
D1 N003 N004 1N4148
D2 GND N004 1N4148
R4 GND X3 100k
XU2 N001 GND a opamp Aol=100K GBW=10Meg  ; pins invin noninvin out
R5 N001 IN 10k
R6 a N001 7.5k
XU3 N002 GND b opamp Aol=100K GBW=10Meg  ; pins invin noninvin out
R7 N002 IN 10k
R8 b N002 12k
A1 N004 0 0 0 MSG x 0 0 XOR Vhigh=5 Vlow=0 Td=2n Trise=10n Tfall=10n
B1 OUT GND V=V(a)*(V(x))/5 + V(b)*(5-V(x))/5
.lib opamp.sub
.ends tsblock_2

.model D D
.lib standard.dio
.tran 0 {10*T} 0 startup
* ( BASED ON A CIRCUIT BY PAUL HOROWITZ )
* LORENZ BUTTERFLY CIRCUIT
* WWW.CHAOTIC-CIRCUITS.COM
***********************************************************************************
**** SPICE MODELING OF AD633 by JIM THOMPSON, http://www.analog-innovations.com/ © 2014 ****
***********************************************************************************
***** Rudimentary Behavioral Model of Analog Devices AD633 Analog Multiplier ******
***** Noise, CMRR and Feed-Thru are not modeled
***********************************************************************************
*** Per Pin Name X1 X2 Y1 Y2 -VS Z  W +VS ***
***              |  |  |  |   |  |  |  |  ***
.SUBCKT AD633_JT 1  2  3  4   5  6  7  8
G_GX1        1 5 VALUE { (1+TANH(22*(V(1,5)-2)))/2*V(ITEMP) }
G_GX2        2 5 VALUE { (1+TANH(22*(V(2,5)-2)))/2*V(ITEMP) }
G_GY1        3 5 VALUE { (1+TANH(22*(V(3,5)-2)))/2*V(ITEMP) }
G_GY2        4 5 VALUE { (1+TANH(22*(V(4,5)-2)))/2*V(ITEMP) }
G_GZ         6 5 VALUE { (1+TANH(22*(V(6,5)-2)))/2*V(ITEMP) }
RCON_TAG3    7 0 1G
E_E1         ITEMP 0 VALUE { 1nA*(489.9-2.0842*TEMP+4.3472m*TEMP*TEMP) }
G_G1         N_1 7 VALUE { 30mA*TANH(450*V(N_2, 7))*V(BOUNDS) }
C_C1         N_2 0  100pF
G_GIQ        8 5 VALUE { (1+TANH(22*(V(8,5)-2)))/2*4mA }
R_RNOF2      7 5  1G
C_COUT       7 5  5pF
E_E3         BOUNDS 0 VALUE {
+  (1+TANH(25*(V(8,7)-2.2)))*(1+TANH(25*(V(7,5)-2.2)))/4 }
R_R1         WINT N_2  1.59155K
E_E2         WINT 0 VALUE { V(1,2)*V(3,4)/10+V(6) }
.MODEL       D D
D_D1         N_3 N_4 D
F_F1         N_3 8 VF_F1 1
VF_F1        8 N_1 0
D_D2         8 N_3 D
R_RNOF1      8 7  1G
F_F2         8 5 VF_F2 1
VF_F2        N_4 8 0
C_C2         6 5  4pF
C_C3         4 5  4pF
C_C4         3 5  4pF
C_C5         2 5  4pF
C_C6         1 5  4pF
.ENDS   AD633_JT
***********************************************************************************
* AD633_JT
* PIN ASSIGNMENT
* PIN1     X1          PIN5     -Vs
* PIN2     X2          PIN6       Z
* PIN3     Y1          PIN7       W
* PIN4     Y2          PIN8     +Vs
.lib opamp.sub
.param C = .1n
.param tolc = 0.01
.param R = 100k
.param tR = 10k
.param pR = 75k
.param sR = 20k
.param bR = 10k
.param sig = 10
.param rho = 3.74
.param T = 1m
.param qR = 47k
.lib LTC1.lib
.backanno
.end